# EAGLE schematic LEDSubMatrixHighDensity_template (EAGLE 9.6.2)
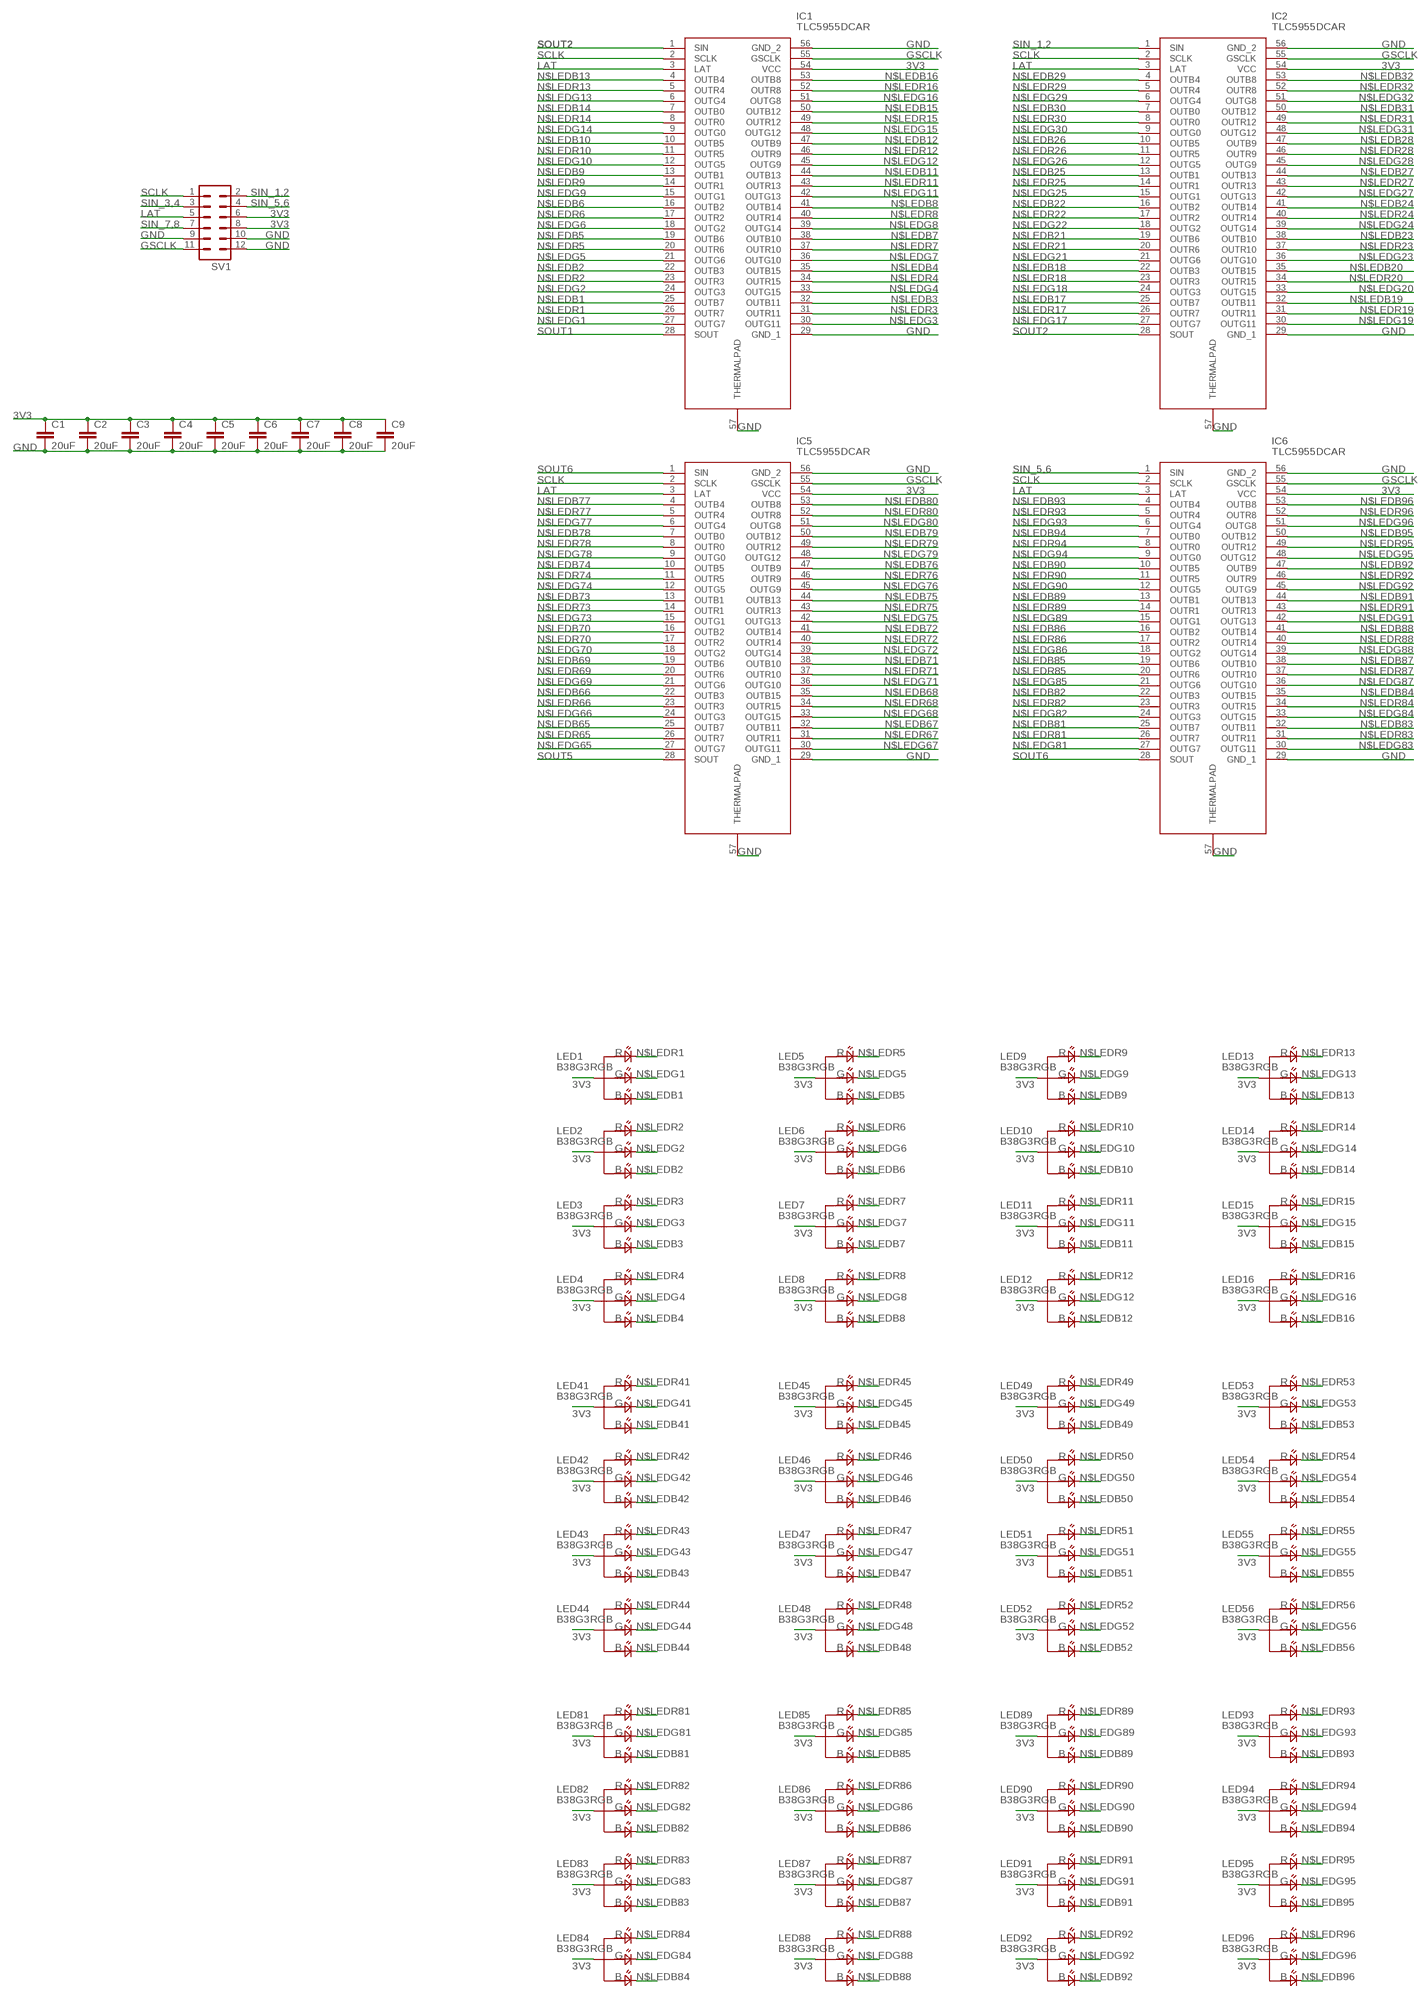
[diagram p0: schematic, sheet 1, part 1 of 2]
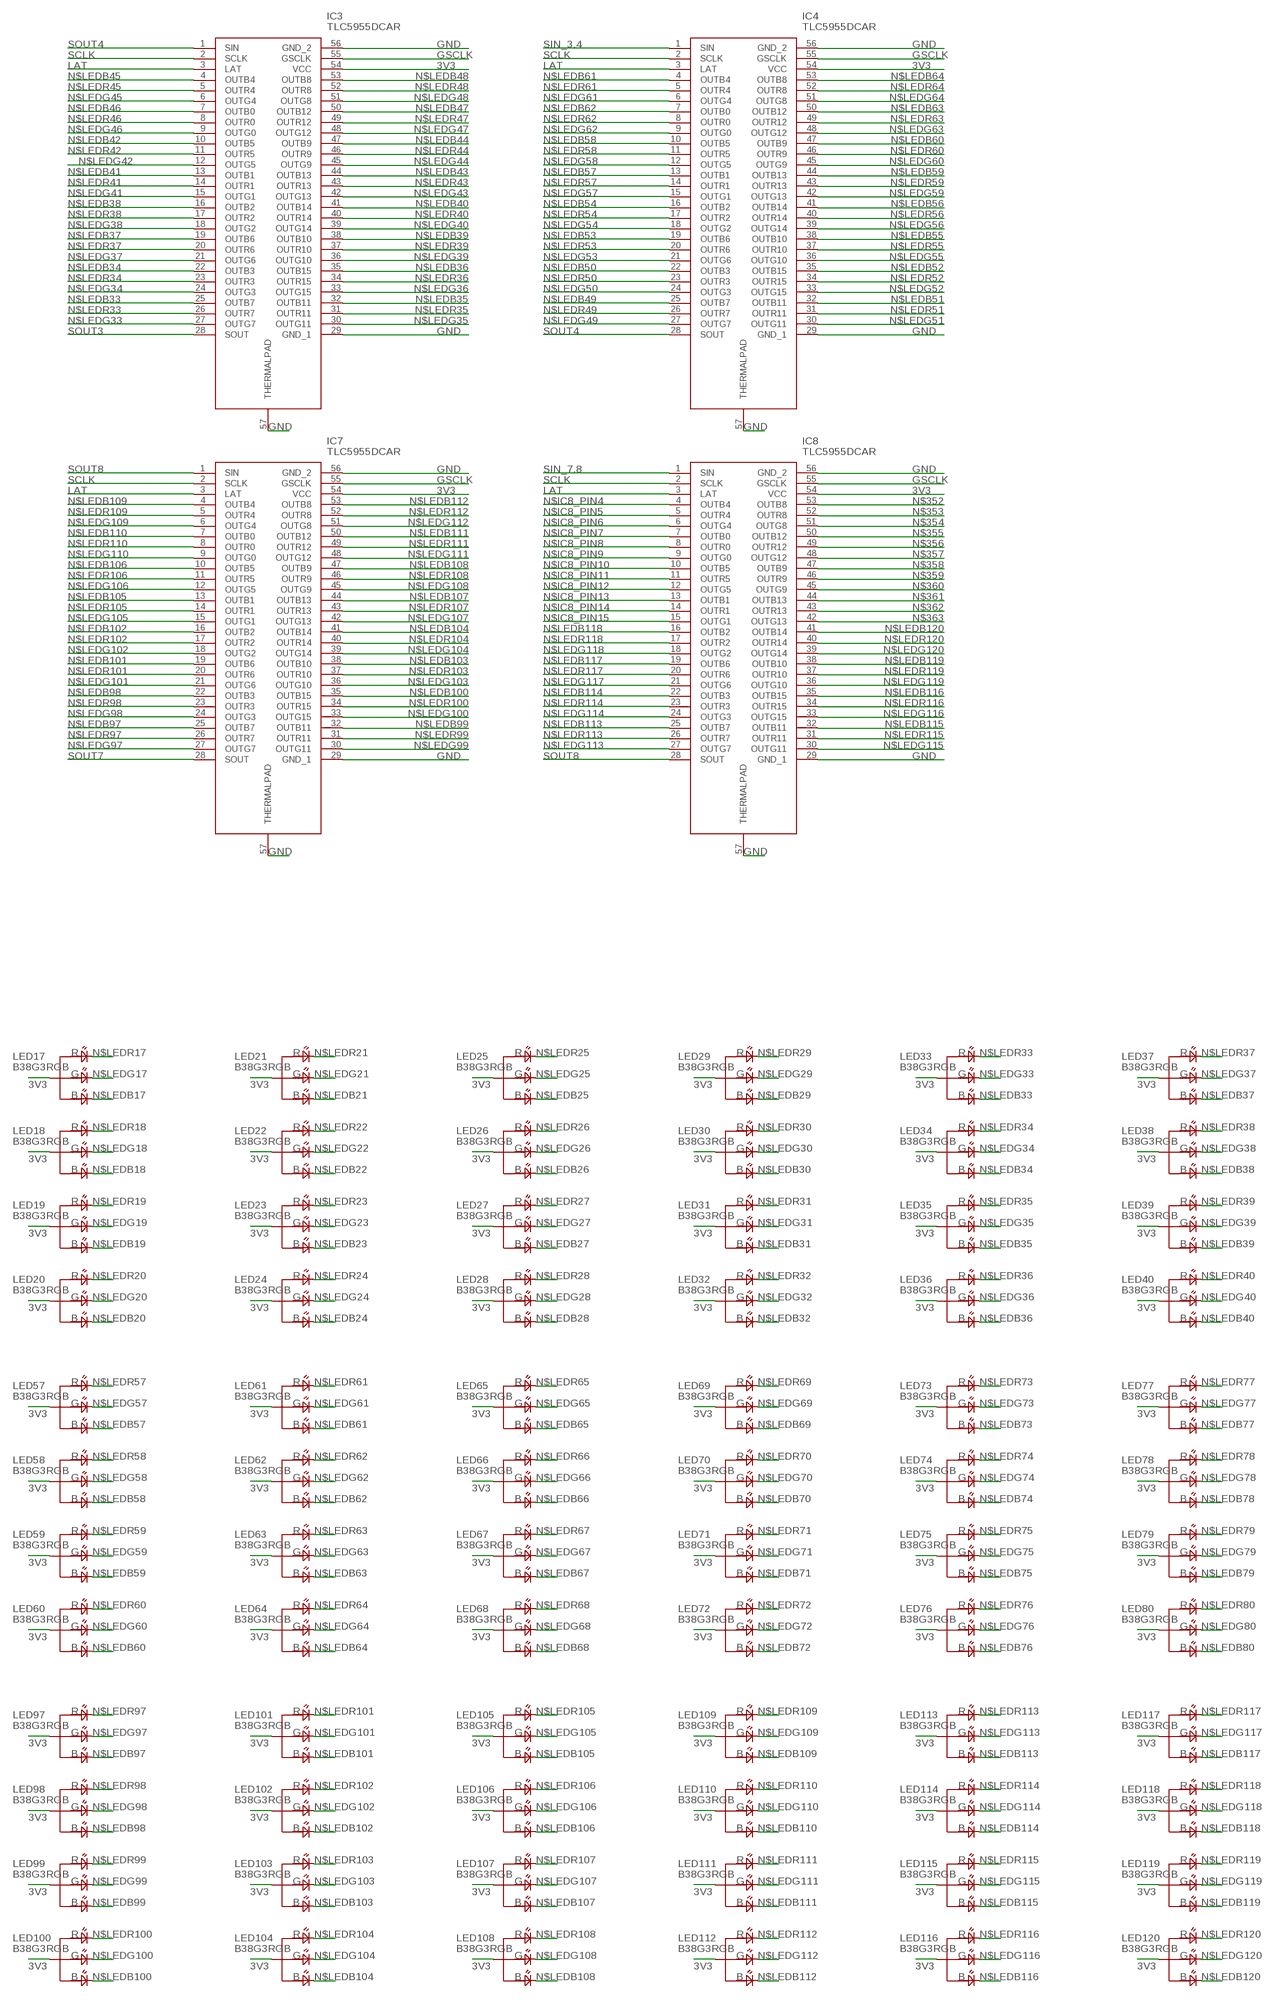
[diagram p1: schematic, sheet 1, part 2 of 2]

## Parts
C1  20uF  C-EUC0603  [C0603]
C2  20uF  C-EUC0603  [C0603]
C3  20uF  C-EUC0603  [C0603]
C4  20uF  C-EUC0603  [C0603]
C5  20uF  C-EUC0603  [C0603]
C6  20uF  C-EUC0603  [C0603]
C7  20uF  C-EUC0603  [C0603]
C8  20uF  C-EUC0603  [C0603]
C9  20uF  C-EUC0805  [C0805]
IC1  TLC5955DCAR  [SOP50P810X120-57N]
IC2  TLC5955DCAR  [SOP50P810X120-57N]
IC3  TLC5955DCAR  [SOP50P810X120-57N]
IC4  TLC5955DCAR  [SOP50P810X120-57N]
IC5  TLC5955DCAR  [SOP50P810X120-57N]
IC6  TLC5955DCAR  [SOP50P810X120-57N]
IC7  TLC5955DCAR  [SOP50P810X120-57N]
IC8  TLC5955DCAR  [SOP50P810X120-57N]
LED1  B38G3RGB  [B38G3RGB]
LED2  B38G3RGB  [B38G3RGB]
LED3  B38G3RGB  [B38G3RGB]
LED4  B38G3RGB  [B38G3RGB]
LED5  B38G3RGB  [B38G3RGB]
LED6  B38G3RGB  [B38G3RGB]
LED7  B38G3RGB  [B38G3RGB]
LED8  B38G3RGB  [B38G3RGB]
LED9  B38G3RGB  [B38G3RGB]
LED10  B38G3RGB  [B38G3RGB]
LED11  B38G3RGB  [B38G3RGB]
LED12  B38G3RGB  [B38G3RGB]
LED13  B38G3RGB  [B38G3RGB]
LED14  B38G3RGB  [B38G3RGB]
LED15  B38G3RGB  [B38G3RGB]
LED16  B38G3RGB  [B38G3RGB]
LED17  B38G3RGB  [B38G3RGB]
LED18  B38G3RGB  [B38G3RGB]
LED19  B38G3RGB  [B38G3RGB]
LED20  B38G3RGB  [B38G3RGB]
LED21  B38G3RGB  [B38G3RGB]
LED22  B38G3RGB  [B38G3RGB]
LED23  B38G3RGB  [B38G3RGB]
LED24  B38G3RGB  [B38G3RGB]
LED25  B38G3RGB  [B38G3RGB]
LED26  B38G3RGB  [B38G3RGB]
LED27  B38G3RGB  [B38G3RGB]
LED28  B38G3RGB  [B38G3RGB]
LED29  B38G3RGB  [B38G3RGB]
LED30  B38G3RGB  [B38G3RGB]
LED31  B38G3RGB  [B38G3RGB]
LED32  B38G3RGB  [B38G3RGB]
LED33  B38G3RGB  [B38G3RGB]
LED34  B38G3RGB  [B38G3RGB]
LED35  B38G3RGB  [B38G3RGB]
LED36  B38G3RGB  [B38G3RGB]
LED37  B38G3RGB  [B38G3RGB]
LED38  B38G3RGB  [B38G3RGB]
LED39  B38G3RGB  [B38G3RGB]
LED40  B38G3RGB  [B38G3RGB]
LED41  B38G3RGB  [B38G3RGB]
LED42  B38G3RGB  [B38G3RGB]
LED43  B38G3RGB  [B38G3RGB]
LED44  B38G3RGB  [B38G3RGB]
LED45  B38G3RGB  [B38G3RGB]
LED46  B38G3RGB  [B38G3RGB]
LED47  B38G3RGB  [B38G3RGB]
LED48  B38G3RGB  [B38G3RGB]
LED49  B38G3RGB  [B38G3RGB]
LED50  B38G3RGB  [B38G3RGB]
LED51  B38G3RGB  [B38G3RGB]
LED52  B38G3RGB  [B38G3RGB]
LED53  B38G3RGB  [B38G3RGB]
LED54  B38G3RGB  [B38G3RGB]
LED55  B38G3RGB  [B38G3RGB]
LED56  B38G3RGB  [B38G3RGB]
LED57  B38G3RGB  [B38G3RGB]
LED58  B38G3RGB  [B38G3RGB]
LED59  B38G3RGB  [B38G3RGB]
LED60  B38G3RGB  [B38G3RGB]
LED61  B38G3RGB  [B38G3RGB]
LED62  B38G3RGB  [B38G3RGB]
LED63  B38G3RGB  [B38G3RGB]
LED64  B38G3RGB  [B38G3RGB]
LED65  B38G3RGB  [B38G3RGB]
LED66  B38G3RGB  [B38G3RGB]
LED67  B38G3RGB  [B38G3RGB]
LED68  B38G3RGB  [B38G3RGB]
LED69  B38G3RGB  [B38G3RGB]
LED70  B38G3RGB  [B38G3RGB]
LED71  B38G3RGB  [B38G3RGB]
LED72  B38G3RGB  [B38G3RGB]
LED73  B38G3RGB  [B38G3RGB]
LED74  B38G3RGB  [B38G3RGB]
LED75  B38G3RGB  [B38G3RGB]
LED76  B38G3RGB  [B38G3RGB]
LED77  B38G3RGB  [B38G3RGB]
LED78  B38G3RGB  [B38G3RGB]
LED79  B38G3RGB  [B38G3RGB]
LED80  B38G3RGB  [B38G3RGB]
LED81  B38G3RGB  [B38G3RGB]
LED82  B38G3RGB  [B38G3RGB]
LED83  B38G3RGB  [B38G3RGB]
LED84  B38G3RGB  [B38G3RGB]
LED85  B38G3RGB  [B38G3RGB]
LED86  B38G3RGB  [B38G3RGB]
LED87  B38G3RGB  [B38G3RGB]
LED88  B38G3RGB  [B38G3RGB]
LED89  B38G3RGB  [B38G3RGB]
LED90  B38G3RGB  [B38G3RGB]
LED91  B38G3RGB  [B38G3RGB]
LED92  B38G3RGB  [B38G3RGB]
LED93  B38G3RGB  [B38G3RGB]
LED94  B38G3RGB  [B38G3RGB]
LED95  B38G3RGB  [B38G3RGB]
LED96  B38G3RGB  [B38G3RGB]
LED97  B38G3RGB  [B38G3RGB]
LED98  B38G3RGB  [B38G3RGB]
LED99  B38G3RGB  [B38G3RGB]
LED100  B38G3RGB  [B38G3RGB]
LED101  B38G3RGB  [B38G3RGB]
LED102  B38G3RGB  [B38G3RGB]
LED103  B38G3RGB  [B38G3RGB]
LED104  B38G3RGB  [B38G3RGB]
LED105  B38G3RGB  [B38G3RGB]
LED106  B38G3RGB  [B38G3RGB]
LED107  B38G3RGB  [B38G3RGB]
LED108  B38G3RGB  [B38G3RGB]
LED109  B38G3RGB  [B38G3RGB]
LED110  B38G3RGB  [B38G3RGB]
LED111  B38G3RGB  [B38G3RGB]
LED112  B38G3RGB  [B38G3RGB]
LED113  B38G3RGB  [B38G3RGB]
LED114  B38G3RGB  [B38G3RGB]
LED115  B38G3RGB  [B38G3RGB]
LED116  B38G3RGB  [B38G3RGB]
LED117  B38G3RGB  [B38G3RGB]
LED118  B38G3RGB  [B38G3RGB]
LED119  B38G3RGB  [B38G3RGB]
LED120  B38G3RGB  [B38G3RGB]
SV1  MA06-2  [MA06-2]

## Nets
3V3: C1.1 C2.1 C3.1 C4.1 C5.1 C6.1 C7.1 C8.1 C9.1 IC1.54(VCC) IC2.54(VCC) IC3.54(VCC) IC4.54(VCC) IC5.54(VCC) IC6.54(VCC) IC7.54(VCC) IC8.54(VCC) LED1.3(COM) LED2.3(COM) LED3.3(COM) LED4.3(COM) LED5.3(COM) LED6.3(COM) LED7.3(COM) LED8.3(COM) LED9.3(COM) LED10.3(COM) LED11.3(COM) LED12.3(COM) LED13.3(COM) LED14.3(COM) LED15.3(COM) LED16.3(COM) LED17.3(COM) LED18.3(COM) LED19.3(COM) LED20.3(COM) LED21.3(COM) LED22.3(COM) LED23.3(COM) LED24.3(COM) LED25.3(COM) LED26.3(COM) LED27.3(COM) LED28.3(COM) LED29.3(COM) LED30.3(COM) LED31.3(COM) LED32.3(COM) LED33.3(COM) LED34.3(COM) LED35.3(COM) LED36.3(COM) LED37.3(COM) LED38.3(COM) LED39.3(COM) LED40.3(COM) LED41.3(COM) LED42.3(COM) LED43.3(COM) LED44.3(COM) LED45.3(COM) LED46.3(COM) LED47.3(COM) LED48.3(COM) LED49.3(COM) LED50.3(COM) LED51.3(COM) LED52.3(COM) LED53.3(COM) LED54.3(COM) LED55.3(COM) LED56.3(COM) LED57.3(COM) LED58.3(COM) LED59.3(COM) LED60.3(COM) LED61.3(COM) LED62.3(COM) LED63.3(COM) LED64.3(COM) LED65.3(COM) LED66.3(COM) LED67.3(COM) LED68.3(COM) LED69.3(COM) LED70.3(COM) LED71.3(COM) LED72.3(COM) LED73.3(COM) LED74.3(COM) LED75.3(COM) LED76.3(COM) LED77.3(COM) LED78.3(COM) LED79.3(COM) LED80.3(COM) LED81.3(COM) LED82.3(COM) LED83.3(COM) LED84.3(COM) LED85.3(COM) LED86.3(COM) LED87.3(COM) LED88.3(COM) LED89.3(COM) LED90.3(COM) LED91.3(COM) LED92.3(COM) LED93.3(COM) LED94.3(COM) LED95.3(COM) LED96.3(COM) LED97.3(COM) LED98.3(COM) LED99.3(COM) LED100.3(COM) LED101.3(COM) LED102.3(COM) LED103.3(COM) LED104.3(COM) LED105.3(COM) LED106.3(COM) LED107.3(COM) LED108.3(COM) LED109.3(COM) LED110.3(COM) LED111.3(COM) LED112.3(COM) LED113.3(COM) LED114.3(COM) LED115.3(COM) LED116.3(COM) LED117.3(COM) LED118.3(COM) LED119.3(COM) LED120.3(COM) SV1.6 SV1.8
GND: C1.2 C2.2 C3.2 C4.2 C5.2 C6.2 C7.2 C8.2 C9.2 IC1.29(GND_1) IC1.56(GND_2) IC1.57(THERMALPAD) IC2.29(GND_1) IC2.56(GND_2) IC2.57(THERMALPAD) IC3.29(GND_1) IC3.56(GND_2) IC3.57(THERMALPAD) IC4.29(GND_1) IC4.56(GND_2) IC4.57(THERMALPAD) IC5.29(GND_1) IC5.56(GND_2) IC5.57(THERMALPAD) IC6.29(GND_1) IC6.56(GND_2) IC6.57(THERMALPAD) IC7.29(GND_1) IC7.56(GND_2) IC7.57(THERMALPAD) IC8.29(GND_1) IC8.56(GND_2) IC8.57(THERMALPAD) SV1.9 SV1.10 SV1.12
GSCLK: IC1.55(GSCLK) IC2.55(GSCLK) IC3.55(GSCLK) IC4.55(GSCLK) IC5.55(GSCLK) IC6.55(GSCLK) IC7.55(GSCLK) IC8.55(GSCLK) SV1.11
LAT: IC1.3(LAT) IC2.3(LAT) IC3.3(LAT) IC4.3(LAT) IC5.3(LAT) IC6.3(LAT) IC7.3(LAT) IC8.3(LAT) SV1.5
N$352: IC8.53(OUTB8)
N$353: IC8.52(OUTR8)
N$354: IC8.51(OUTG8)
N$355: IC8.50(OUTB12)
N$356: IC8.49(OUTR12)
N$357: IC8.48(OUTG12)
N$358: IC8.47(OUTB9)
N$359: IC8.46(OUTR9)
N$360: IC8.45(OUTG9)
N$361: IC8.44(OUTB13)
N$362: IC8.43(OUTR13)
N$363: IC8.42(OUTG13)
N$IC8_PIN4: IC8.4(OUTB4)
N$IC8_PIN5: IC8.5(OUTR4)
N$IC8_PIN6: IC8.6(OUTG4)
N$IC8_PIN7: IC8.7(OUTB0)
N$IC8_PIN8: IC8.8(OUTR0)
N$IC8_PIN9: IC8.9(OUTG0)
N$IC8_PIN10: IC8.10(OUTB5)
N$IC8_PIN11: IC8.11(OUTR5)
N$IC8_PIN12: IC8.12(OUTG5)
N$IC8_PIN13: IC8.13(OUTB1)
N$IC8_PIN14: IC8.14(OUTR1)
N$IC8_PIN15: IC8.15(OUTG1)
N$LEDB1: IC1.25(OUTB7) LED1.2(BLUE)
N$LEDB2: IC1.22(OUTB3) LED2.2(BLUE)
N$LEDB3: IC1.32(OUTB11) LED3.2(BLUE)
N$LEDB4: IC1.35(OUTB15) LED4.2(BLUE)
N$LEDB5: IC1.19(OUTB6) LED5.2(BLUE)
N$LEDB6: IC1.16(OUTB2) LED6.2(BLUE)
N$LEDB7: IC1.38(OUTB10) LED7.2(BLUE)
N$LEDB8: IC1.41(OUTB14) LED8.2(BLUE)
N$LEDB9: IC1.13(OUTB1) LED9.2(BLUE)
N$LEDB10: IC1.10(OUTB5) LED10.2(BLUE)
N$LEDB11: IC1.44(OUTB13) LED11.2(BLUE)
N$LEDB12: IC1.47(OUTB9) LED12.2(BLUE)
N$LEDB13: IC1.4(OUTB4) LED13.2(BLUE)
N$LEDB14: IC1.7(OUTB0) LED14.2(BLUE)
N$LEDB15: IC1.50(OUTB12) LED15.2(BLUE)
N$LEDB16: IC1.53(OUTB8) LED16.2(BLUE)
N$LEDB17: IC2.25(OUTB7) LED17.2(BLUE)
N$LEDB18: IC2.22(OUTB3) LED18.2(BLUE)
N$LEDB19: IC2.32(OUTB11) LED19.2(BLUE)
N$LEDB20: IC2.35(OUTB15) LED20.2(BLUE)
N$LEDB21: IC2.19(OUTB6) LED21.2(BLUE)
N$LEDB22: IC2.16(OUTB2) LED22.2(BLUE)
N$LEDB23: IC2.38(OUTB10) LED23.2(BLUE)
N$LEDB24: IC2.41(OUTB14) LED24.2(BLUE)
N$LEDB25: IC2.13(OUTB1) LED25.2(BLUE)
N$LEDB26: IC2.10(OUTB5) LED26.2(BLUE)
N$LEDB27: IC2.44(OUTB13) LED27.2(BLUE)
N$LEDB28: IC2.47(OUTB9) LED28.2(BLUE)
N$LEDB29: IC2.4(OUTB4) LED29.2(BLUE)
N$LEDB30: IC2.7(OUTB0) LED30.2(BLUE)
N$LEDB31: IC2.50(OUTB12) LED31.2(BLUE)
N$LEDB32: IC2.53(OUTB8) LED32.2(BLUE)
N$LEDB33: IC3.25(OUTB7) LED33.2(BLUE)
N$LEDB34: IC3.22(OUTB3) LED34.2(BLUE)
N$LEDB35: IC3.32(OUTB11) LED35.2(BLUE)
N$LEDB36: IC3.35(OUTB15) LED36.2(BLUE)
N$LEDB37: IC3.19(OUTB6) LED37.2(BLUE)
N$LEDB38: IC3.16(OUTB2) LED38.2(BLUE)
N$LEDB39: IC3.38(OUTB10) LED39.2(BLUE)
N$LEDB40: IC3.41(OUTB14) LED40.2(BLUE)
N$LEDB41: IC3.13(OUTB1) LED41.2(BLUE)
N$LEDB42: IC3.10(OUTB5) LED42.2(BLUE)
N$LEDB43: IC3.44(OUTB13) LED43.2(BLUE)
N$LEDB44: IC3.47(OUTB9) LED44.2(BLUE)
N$LEDB45: IC3.4(OUTB4) LED45.2(BLUE)
N$LEDB46: IC3.7(OUTB0) LED46.2(BLUE)
N$LEDB47: IC3.50(OUTB12) LED47.2(BLUE)
N$LEDB48: IC3.53(OUTB8) LED48.2(BLUE)
N$LEDB49: IC4.25(OUTB7) LED49.2(BLUE)
N$LEDB50: IC4.22(OUTB3) LED50.2(BLUE)
N$LEDB51: IC4.32(OUTB11) LED51.2(BLUE)
N$LEDB52: IC4.35(OUTB15) LED52.2(BLUE)
N$LEDB53: IC4.19(OUTB6) LED53.2(BLUE)
N$LEDB54: IC4.16(OUTB2) LED54.2(BLUE)
N$LEDB55: IC4.38(OUTB10) LED55.2(BLUE)
N$LEDB56: IC4.41(OUTB14) LED56.2(BLUE)
N$LEDB57: IC4.13(OUTB1) LED57.2(BLUE)
N$LEDB58: IC4.10(OUTB5) LED58.2(BLUE)
N$LEDB59: IC4.44(OUTB13) LED59.2(BLUE)
N$LEDB60: IC4.47(OUTB9) LED60.2(BLUE)
N$LEDB61: IC4.4(OUTB4) LED61.2(BLUE)
N$LEDB62: IC4.7(OUTB0) LED62.2(BLUE)
N$LEDB63: IC4.50(OUTB12) LED63.2(BLUE)
N$LEDB64: IC4.53(OUTB8) LED64.2(BLUE)
N$LEDB65: IC5.25(OUTB7) LED65.2(BLUE)
N$LEDB66: IC5.22(OUTB3) LED66.2(BLUE)
N$LEDB67: IC5.32(OUTB11) LED67.2(BLUE)
N$LEDB68: IC5.35(OUTB15) LED68.2(BLUE)
N$LEDB69: IC5.19(OUTB6) LED69.2(BLUE)
N$LEDB70: IC5.16(OUTB2) LED70.2(BLUE)
N$LEDB71: IC5.38(OUTB10) LED71.2(BLUE)
N$LEDB72: IC5.41(OUTB14) LED72.2(BLUE)
N$LEDB73: IC5.13(OUTB1) LED73.2(BLUE)
N$LEDB74: IC5.10(OUTB5) LED74.2(BLUE)
N$LEDB75: IC5.44(OUTB13) LED75.2(BLUE)
N$LEDB76: IC5.47(OUTB9) LED76.2(BLUE)
N$LEDB77: IC5.4(OUTB4) LED77.2(BLUE)
N$LEDB78: IC5.7(OUTB0) LED78.2(BLUE)
N$LEDB79: IC5.50(OUTB12) LED79.2(BLUE)
N$LEDB80: IC5.53(OUTB8) LED80.2(BLUE)
N$LEDB81: IC6.25(OUTB7) LED81.2(BLUE)
N$LEDB82: IC6.22(OUTB3) LED82.2(BLUE)
N$LEDB83: IC6.32(OUTB11) LED83.2(BLUE)
N$LEDB84: IC6.35(OUTB15) LED84.2(BLUE)
N$LEDB85: IC6.19(OUTB6) LED85.2(BLUE)
N$LEDB86: IC6.16(OUTB2) LED86.2(BLUE)
N$LEDB87: IC6.38(OUTB10) LED87.2(BLUE)
N$LEDB88: IC6.41(OUTB14) LED88.2(BLUE)
N$LEDB89: IC6.13(OUTB1) LED89.2(BLUE)
N$LEDB90: IC6.10(OUTB5) LED90.2(BLUE)
N$LEDB91: IC6.44(OUTB13) LED91.2(BLUE)
N$LEDB92: IC6.47(OUTB9) LED92.2(BLUE)
N$LEDB93: IC6.4(OUTB4) LED93.2(BLUE)
N$LEDB94: IC6.7(OUTB0) LED94.2(BLUE)
N$LEDB95: IC6.50(OUTB12) LED95.2(BLUE)
N$LEDB96: IC6.53(OUTB8) LED96.2(BLUE)
N$LEDB97: IC7.25(OUTB7) LED97.2(BLUE)
N$LEDB98: IC7.22(OUTB3) LED98.2(BLUE)
N$LEDB99: IC7.32(OUTB11) LED99.2(BLUE)
N$LEDB100: IC7.35(OUTB15) LED100.2(BLUE)
N$LEDB101: IC7.19(OUTB6) LED101.2(BLUE)
N$LEDB102: IC7.16(OUTB2) LED102.2(BLUE)
N$LEDB103: IC7.38(OUTB10) LED103.2(BLUE)
N$LEDB104: IC7.41(OUTB14) LED104.2(BLUE)
N$LEDB105: IC7.13(OUTB1) LED105.2(BLUE)
N$LEDB106: IC7.10(OUTB5) LED106.2(BLUE)
N$LEDB107: IC7.44(OUTB13) LED107.2(BLUE)
N$LEDB108: IC7.47(OUTB9) LED108.2(BLUE)
N$LEDB109: IC7.4(OUTB4) LED109.2(BLUE)
N$LEDB110: IC7.7(OUTB0) LED110.2(BLUE)
N$LEDB111: IC7.50(OUTB12) LED111.2(BLUE)
N$LEDB112: IC7.53(OUTB8) LED112.2(BLUE)
N$LEDB113: IC8.25(OUTB7) LED113.2(BLUE)
N$LEDB114: IC8.22(OUTB3) LED114.2(BLUE)
N$LEDB115: IC8.32(OUTB11) LED115.2(BLUE)
N$LEDB116: IC8.35(OUTB15) LED116.2(BLUE)
N$LEDB117: IC8.19(OUTB6) LED117.2(BLUE)
N$LEDB118: IC8.16(OUTB2) LED118.2(BLUE)
N$LEDB119: IC8.38(OUTB10) LED119.2(BLUE)
N$LEDB120: IC8.41(OUTB14) LED120.2(BLUE)
N$LEDG1: IC1.27(OUTG7) LED1.1(GREEN)
N$LEDG2: IC1.24(OUTG3) LED2.1(GREEN)
N$LEDG3: IC1.30(OUTG11) LED3.1(GREEN)
N$LEDG4: IC1.33(OUTG15) LED4.1(GREEN)
N$LEDG5: IC1.21(OUTG6) LED5.1(GREEN)
N$LEDG6: IC1.18(OUTG2) LED6.1(GREEN)
N$LEDG7: IC1.36(OUTG10) LED7.1(GREEN)
N$LEDG8: IC1.39(OUTG14) LED8.1(GREEN)
N$LEDG9: IC1.15(OUTG1) LED9.1(GREEN)
N$LEDG10: IC1.12(OUTG5) LED10.1(GREEN)
N$LEDG11: IC1.42(OUTG13) LED11.1(GREEN)
N$LEDG12: IC1.45(OUTG9) LED12.1(GREEN)
N$LEDG13: IC1.6(OUTG4) LED13.1(GREEN)
N$LEDG14: IC1.9(OUTG0) LED14.1(GREEN)
N$LEDG15: IC1.48(OUTG12) LED15.1(GREEN)
N$LEDG16: IC1.51(OUTG8) LED16.1(GREEN)
N$LEDG17: IC2.27(OUTG7) LED17.1(GREEN)
N$LEDG18: IC2.24(OUTG3) LED18.1(GREEN)
N$LEDG19: IC2.30(OUTG11) LED19.1(GREEN)
N$LEDG20: IC2.33(OUTG15) LED20.1(GREEN)
N$LEDG21: IC2.21(OUTG6) LED21.1(GREEN)
N$LEDG22: IC2.18(OUTG2) LED22.1(GREEN)
N$LEDG23: IC2.36(OUTG10) LED23.1(GREEN)
N$LEDG24: IC2.39(OUTG14) LED24.1(GREEN)
N$LEDG25: IC2.15(OUTG1) LED25.1(GREEN)
N$LEDG26: IC2.12(OUTG5) LED26.1(GREEN)
N$LEDG27: IC2.42(OUTG13) LED27.1(GREEN)
N$LEDG28: IC2.45(OUTG9) LED28.1(GREEN)
N$LEDG29: IC2.6(OUTG4) LED29.1(GREEN)
N$LEDG30: IC2.9(OUTG0) LED30.1(GREEN)
N$LEDG31: IC2.48(OUTG12) LED31.1(GREEN)
N$LEDG32: IC2.51(OUTG8) LED32.1(GREEN)
N$LEDG33: IC3.27(OUTG7) LED33.1(GREEN)
N$LEDG34: IC3.24(OUTG3) LED34.1(GREEN)
N$LEDG35: IC3.30(OUTG11) LED35.1(GREEN)
N$LEDG36: IC3.33(OUTG15) LED36.1(GREEN)
N$LEDG37: IC3.21(OUTG6) LED37.1(GREEN)
N$LEDG38: IC3.18(OUTG2) LED38.1(GREEN)
N$LEDG39: IC3.36(OUTG10) LED39.1(GREEN)
N$LEDG40: IC3.39(OUTG14) LED40.1(GREEN)
N$LEDG41: IC3.15(OUTG1) LED41.1(GREEN)
N$LEDG42: IC3.12(OUTG5) LED42.1(GREEN)
N$LEDG43: IC3.42(OUTG13) LED43.1(GREEN)
N$LEDG44: IC3.45(OUTG9) LED44.1(GREEN)
N$LEDG45: IC3.6(OUTG4) LED45.1(GREEN)
N$LEDG46: IC3.9(OUTG0) LED46.1(GREEN)
N$LEDG47: IC3.48(OUTG12) LED47.1(GREEN)
N$LEDG48: IC3.51(OUTG8) LED48.1(GREEN)
N$LEDG49: IC4.27(OUTG7) LED49.1(GREEN)
N$LEDG50: IC4.24(OUTG3) LED50.1(GREEN)
N$LEDG51: IC4.30(OUTG11) LED51.1(GREEN)
N$LEDG52: IC4.33(OUTG15) LED52.1(GREEN)
N$LEDG53: IC4.21(OUTG6) LED53.1(GREEN)
N$LEDG54: IC4.18(OUTG2) LED54.1(GREEN)
N$LEDG55: IC4.36(OUTG10) LED55.1(GREEN)
N$LEDG56: IC4.39(OUTG14) LED56.1(GREEN)
N$LEDG57: IC4.15(OUTG1) LED57.1(GREEN)
N$LEDG58: IC4.12(OUTG5) LED58.1(GREEN)
N$LEDG59: IC4.42(OUTG13) LED59.1(GREEN)
N$LEDG60: IC4.45(OUTG9) LED60.1(GREEN)
N$LEDG61: IC4.6(OUTG4) LED61.1(GREEN)
N$LEDG62: IC4.9(OUTG0) LED62.1(GREEN)
N$LEDG63: IC4.48(OUTG12) LED63.1(GREEN)
N$LEDG64: IC4.51(OUTG8) LED64.1(GREEN)
N$LEDG65: IC5.27(OUTG7) LED65.1(GREEN)
N$LEDG66: IC5.24(OUTG3) LED66.1(GREEN)
N$LEDG67: IC5.30(OUTG11) LED67.1(GREEN)
N$LEDG68: IC5.33(OUTG15) LED68.1(GREEN)
N$LEDG69: IC5.21(OUTG6) LED69.1(GREEN)
N$LEDG70: IC5.18(OUTG2) LED70.1(GREEN)
N$LEDG71: IC5.36(OUTG10) LED71.1(GREEN)
N$LEDG72: IC5.39(OUTG14) LED72.1(GREEN)
N$LEDG73: IC5.15(OUTG1) LED73.1(GREEN)
N$LEDG74: IC5.12(OUTG5) LED74.1(GREEN)
N$LEDG75: IC5.42(OUTG13) LED75.1(GREEN)
N$LEDG76: IC5.45(OUTG9) LED76.1(GREEN)
N$LEDG77: IC5.6(OUTG4) LED77.1(GREEN)
N$LEDG78: IC5.9(OUTG0) LED78.1(GREEN)
N$LEDG79: IC5.48(OUTG12) LED79.1(GREEN)
N$LEDG80: IC5.51(OUTG8) LED80.1(GREEN)
N$LEDG81: IC6.27(OUTG7) LED81.1(GREEN)
N$LEDG82: IC6.24(OUTG3) LED82.1(GREEN)
N$LEDG83: IC6.30(OUTG11) LED83.1(GREEN)
N$LEDG84: IC6.33(OUTG15) LED84.1(GREEN)
N$LEDG85: IC6.21(OUTG6) LED85.1(GREEN)
N$LEDG86: IC6.18(OUTG2) LED86.1(GREEN)
N$LEDG87: IC6.36(OUTG10) LED87.1(GREEN)
N$LEDG88: IC6.39(OUTG14) LED88.1(GREEN)
N$LEDG89: IC6.15(OUTG1) LED89.1(GREEN)
N$LEDG90: IC6.12(OUTG5) LED90.1(GREEN)
N$LEDG91: IC6.42(OUTG13) LED91.1(GREEN)
N$LEDG92: IC6.45(OUTG9) LED92.1(GREEN)
N$LEDG93: IC6.6(OUTG4) LED93.1(GREEN)
N$LEDG94: IC6.9(OUTG0) LED94.1(GREEN)
N$LEDG95: IC6.48(OUTG12) LED95.1(GREEN)
N$LEDG96: IC6.51(OUTG8) LED96.1(GREEN)
N$LEDG97: IC7.27(OUTG7) LED97.1(GREEN)
N$LEDG98: IC7.24(OUTG3) LED98.1(GREEN)
N$LEDG99: IC7.30(OUTG11) LED99.1(GREEN)
N$LEDG100: IC7.33(OUTG15) LED100.1(GREEN)
N$LEDG101: IC7.21(OUTG6) LED101.1(GREEN)
N$LEDG102: IC7.18(OUTG2) LED102.1(GREEN)
N$LEDG103: IC7.36(OUTG10) LED103.1(GREEN)
N$LEDG104: IC7.39(OUTG14) LED104.1(GREEN)
N$LEDG105: IC7.15(OUTG1) LED105.1(GREEN)
N$LEDG106: IC7.12(OUTG5) LED106.1(GREEN)
N$LEDG107: IC7.42(OUTG13) LED107.1(GREEN)
N$LEDG108: IC7.45(OUTG9) LED108.1(GREEN)
N$LEDG109: IC7.6(OUTG4) LED109.1(GREEN)
N$LEDG110: IC7.9(OUTG0) LED110.1(GREEN)
N$LEDG111: IC7.48(OUTG12) LED111.1(GREEN)
N$LEDG112: IC7.51(OUTG8) LED112.1(GREEN)
N$LEDG113: IC8.27(OUTG7) LED113.1(GREEN)
N$LEDG114: IC8.24(OUTG3) LED114.1(GREEN)
N$LEDG115: IC8.30(OUTG11) LED115.1(GREEN)
N$LEDG116: IC8.33(OUTG15) LED116.1(GREEN)
N$LEDG117: IC8.21(OUTG6) LED117.1(GREEN)
N$LEDG118: IC8.18(OUTG2) LED118.1(GREEN)
N$LEDG119: IC8.36(OUTG10) LED119.1(GREEN)
N$LEDG120: IC8.39(OUTG14) LED120.1(GREEN)
N$LEDR1: IC1.26(OUTR7) LED1.4(RED)
N$LEDR2: IC1.23(OUTR3) LED2.4(RED)
N$LEDR3: IC1.31(OUTR11) LED3.4(RED)
N$LEDR4: IC1.34(OUTR15) LED4.4(RED)
N$LEDR5: IC1.20(OUTR6) LED5.4(RED)
N$LEDR6: IC1.17(OUTR2) LED6.4(RED)
N$LEDR7: IC1.37(OUTR10) LED7.4(RED)
N$LEDR8: IC1.40(OUTR14) LED8.4(RED)
N$LEDR9: IC1.14(OUTR1) LED9.4(RED)
N$LEDR10: IC1.11(OUTR5) LED10.4(RED)
N$LEDR11: IC1.43(OUTR13) LED11.4(RED)
N$LEDR12: IC1.46(OUTR9) LED12.4(RED)
N$LEDR13: IC1.5(OUTR4) LED13.4(RED)
N$LEDR14: IC1.8(OUTR0) LED14.4(RED)
N$LEDR15: IC1.49(OUTR12) LED15.4(RED)
N$LEDR16: IC1.52(OUTR8) LED16.4(RED)
N$LEDR17: IC2.26(OUTR7) LED17.4(RED)
N$LEDR18: IC2.23(OUTR3) LED18.4(RED)
N$LEDR19: IC2.31(OUTR11) LED19.4(RED)
N$LEDR20: IC2.34(OUTR15) LED20.4(RED)
N$LEDR21: IC2.20(OUTR6) LED21.4(RED)
N$LEDR22: IC2.17(OUTR2) LED22.4(RED)
N$LEDR23: IC2.37(OUTR10) LED23.4(RED)
N$LEDR24: IC2.40(OUTR14) LED24.4(RED)
N$LEDR25: IC2.14(OUTR1) LED25.4(RED)
N$LEDR26: IC2.11(OUTR5) LED26.4(RED)
N$LEDR27: IC2.43(OUTR13) LED27.4(RED)
N$LEDR28: IC2.46(OUTR9) LED28.4(RED)
N$LEDR29: IC2.5(OUTR4) LED29.4(RED)
N$LEDR30: IC2.8(OUTR0) LED30.4(RED)
N$LEDR31: IC2.49(OUTR12) LED31.4(RED)
N$LEDR32: IC2.52(OUTR8) LED32.4(RED)
N$LEDR33: IC3.26(OUTR7) LED33.4(RED)
N$LEDR34: IC3.23(OUTR3) LED34.4(RED)
N$LEDR35: IC3.31(OUTR11) LED35.4(RED)
N$LEDR36: IC3.34(OUTR15) LED36.4(RED)
N$LEDR37: IC3.20(OUTR6) LED37.4(RED)
N$LEDR38: IC3.17(OUTR2) LED38.4(RED)
N$LEDR39: IC3.37(OUTR10) LED39.4(RED)
N$LEDR40: IC3.40(OUTR14) LED40.4(RED)
N$LEDR41: IC3.14(OUTR1) LED41.4(RED)
N$LEDR42: IC3.11(OUTR5) LED42.4(RED)
N$LEDR43: IC3.43(OUTR13) LED43.4(RED)
N$LEDR44: IC3.46(OUTR9) LED44.4(RED)
N$LEDR45: IC3.5(OUTR4) LED45.4(RED)
N$LEDR46: IC3.8(OUTR0) LED46.4(RED)
N$LEDR47: IC3.49(OUTR12) LED47.4(RED)
N$LEDR48: IC3.52(OUTR8) LED48.4(RED)
N$LEDR49: IC4.26(OUTR7) LED49.4(RED)
N$LEDR50: IC4.23(OUTR3) LED50.4(RED)
N$LEDR51: IC4.31(OUTR11) LED51.4(RED)
N$LEDR52: IC4.34(OUTR15) LED52.4(RED)
N$LEDR53: IC4.20(OUTR6) LED53.4(RED)
N$LEDR54: IC4.17(OUTR2) LED54.4(RED)
N$LEDR55: IC4.37(OUTR10) LED55.4(RED)
N$LEDR56: IC4.40(OUTR14) LED56.4(RED)
N$LEDR57: IC4.14(OUTR1) LED57.4(RED)
N$LEDR58: IC4.11(OUTR5) LED58.4(RED)
N$LEDR59: IC4.43(OUTR13) LED59.4(RED)
N$LEDR60: IC4.46(OUTR9) LED60.4(RED)
N$LEDR61: IC4.5(OUTR4) LED61.4(RED)
N$LEDR62: IC4.8(OUTR0) LED62.4(RED)
N$LEDR63: IC4.49(OUTR12) LED63.4(RED)
N$LEDR64: IC4.52(OUTR8) LED64.4(RED)
N$LEDR65: IC5.26(OUTR7) LED65.4(RED)
N$LEDR66: IC5.23(OUTR3) LED66.4(RED)
N$LEDR67: IC5.31(OUTR11) LED67.4(RED)
N$LEDR68: IC5.34(OUTR15) LED68.4(RED)
N$LEDR69: IC5.20(OUTR6) LED69.4(RED)
N$LEDR70: IC5.17(OUTR2) LED70.4(RED)
N$LEDR71: IC5.37(OUTR10) LED71.4(RED)
N$LEDR72: IC5.40(OUTR14) LED72.4(RED)
N$LEDR73: IC5.14(OUTR1) LED73.4(RED)
N$LEDR74: IC5.11(OUTR5) LED74.4(RED)
N$LEDR75: IC5.43(OUTR13) LED75.4(RED)
N$LEDR76: IC5.46(OUTR9) LED76.4(RED)
N$LEDR77: IC5.5(OUTR4) LED77.4(RED)
N$LEDR78: IC5.8(OUTR0) LED78.4(RED)
N$LEDR79: IC5.49(OUTR12) LED79.4(RED)
N$LEDR80: IC5.52(OUTR8) LED80.4(RED)
N$LEDR81: IC6.26(OUTR7) LED81.4(RED)
N$LEDR82: IC6.23(OUTR3) LED82.4(RED)
N$LEDR83: IC6.31(OUTR11) LED83.4(RED)
N$LEDR84: IC6.34(OUTR15) LED84.4(RED)
N$LEDR85: IC6.20(OUTR6) LED85.4(RED)
N$LEDR86: IC6.17(OUTR2) LED86.4(RED)
N$LEDR87: IC6.37(OUTR10) LED87.4(RED)
N$LEDR88: IC6.40(OUTR14) LED88.4(RED)
N$LEDR89: IC6.14(OUTR1) LED89.4(RED)
N$LEDR90: IC6.11(OUTR5) LED90.4(RED)
N$LEDR91: IC6.43(OUTR13) LED91.4(RED)
N$LEDR92: IC6.46(OUTR9) LED92.4(RED)
N$LEDR93: IC6.5(OUTR4) LED93.4(RED)
N$LEDR94: IC6.8(OUTR0) LED94.4(RED)
N$LEDR95: IC6.49(OUTR12) LED95.4(RED)
N$LEDR96: IC6.52(OUTR8) LED96.4(RED)
N$LEDR97: IC7.26(OUTR7) LED97.4(RED)
N$LEDR98: IC7.23(OUTR3) LED98.4(RED)
N$LEDR99: IC7.31(OUTR11) LED99.4(RED)
N$LEDR100: IC7.34(OUTR15) LED100.4(RED)
N$LEDR101: IC7.20(OUTR6) LED101.4(RED)
N$LEDR102: IC7.17(OUTR2) LED102.4(RED)
N$LEDR103: IC7.37(OUTR10) LED103.4(RED)
N$LEDR104: IC7.40(OUTR14) LED104.4(RED)
N$LEDR105: IC7.14(OUTR1) LED105.4(RED)
N$LEDR106: IC7.11(OUTR5) LED106.4(RED)
N$LEDR107: IC7.43(OUTR13) LED107.4(RED)
N$LEDR108: IC7.46(OUTR9) LED108.4(RED)
N$LEDR109: IC7.5(OUTR4) LED109.4(RED)
N$LEDR110: IC7.8(OUTR0) LED110.4(RED)
N$LEDR111: IC7.49(OUTR12) LED111.4(RED)
N$LEDR112: IC7.52(OUTR8) LED112.4(RED)
N$LEDR113: IC8.26(OUTR7) LED113.4(RED)
N$LEDR114: IC8.23(OUTR3) LED114.4(RED)
N$LEDR115: IC8.31(OUTR11) LED115.4(RED)
N$LEDR116: IC8.34(OUTR15) LED116.4(RED)
N$LEDR117: IC8.20(OUTR6) LED117.4(RED)
N$LEDR118: IC8.17(OUTR2) LED118.4(RED)
N$LEDR119: IC8.37(OUTR10) LED119.4(RED)
N$LEDR120: IC8.40(OUTR14) LED120.4(RED)
SCLK: IC1.2(SCLK) IC2.2(SCLK) IC3.2(SCLK) IC4.2(SCLK) IC5.2(SCLK) IC6.2(SCLK) IC7.2(SCLK) IC8.2(SCLK) SV1.1
SIN_1,2: IC2.1(SIN) SV1.2
SIN_3,4: IC4.1(SIN) SV1.3
SIN_5,6: IC6.1(SIN) SV1.4
SIN_7,8: IC8.1(SIN) SV1.7
SOUT1: IC1.28(SOUT)
SOUT2: IC1.1(SIN) IC2.28(SOUT)
SOUT3: IC3.28(SOUT)
SOUT4: IC3.1(SIN) IC4.28(SOUT)
SOUT5: IC5.28(SOUT)
SOUT6: IC5.1(SIN) IC6.28(SOUT)
SOUT7: IC7.28(SOUT)
SOUT8: IC7.1(SIN) IC8.28(SOUT)

## Library data of the parts
C1-C9 = rcl:C-EU: CAPACITOR, European symbol; SPICEPREFIX: C
IC1-IC8 = TLC5955DCAR:TLC5955DCAR: 48ch, 16bit PWM LED Driver with Dot-Correction, Brightness Control, Open/Short Detection Source: Datasheet <http://www.ti.com/lit/ds/symlink/tlc5955.pdf>; ARROW_PART_NUMBER: TLC5955DCAR; ARROW_PRICE-STOCK: https://www.arrow.com/en/products/tlc5955dcar/texas-instruments; DESCRIPTION: 48ch, 16bit PWM LED Driver with Dot-Correction, Brightness Control, Open/Short Detection; HEIGHT: 1.2mm; MANUFACTURER_NAME: Texas Instruments; MANUFACTURER_PART_NUMBER: TLC5955DCAR; MOUSER_PART_NUMBER: 595-TLC5955DCAR; MOUSER_PRICE-STOCK: https://www.mouser.co.uk/ProductDetail/Texas-Instruments/TLC5955DCAR?qs=%2Fd%252BFzHvH4c3zo%2FeGYG5n7g%3D%3D
LED1-LED120 = B38G3RGB:B38G3RGB: Standard LEDs - SMD Surface Mount LEDs Source: Datasheet <https://www.arrow.com/en/products/sml-lx0606igc-tr/lumex>; ARROW_PART_NUMBER: SML-LX0606IGC-TR; ARROW_PRICE-STOCK: https://www.arrow.com/en/products/sml-lx0606igc-tr/lumex; DESCRIPTION: Standard LEDs - SMD Surface Mount LEDs; HEIGHT: 0.7mm; MANUFACTURER_NAME: Lumex; MANUFACTURER_PART_NUMBER: SML-LX0606IGC-TR; MOUSER_PART_NUMBER: 696-SML-0606IGCTR; MOUSER_PRICE-STOCK: https://www.mouser.co.uk/ProductDetail/Lumex/SML-LX0606IGC-TR?qs=I1ILoAvtKy%252BVd7WFwiUkZQ%3D%3D
SV1 = VoxelEagleLib:MA06-2: PIN HEADER; OC_FARNELL: unknown; OC_NEWARK: unknown